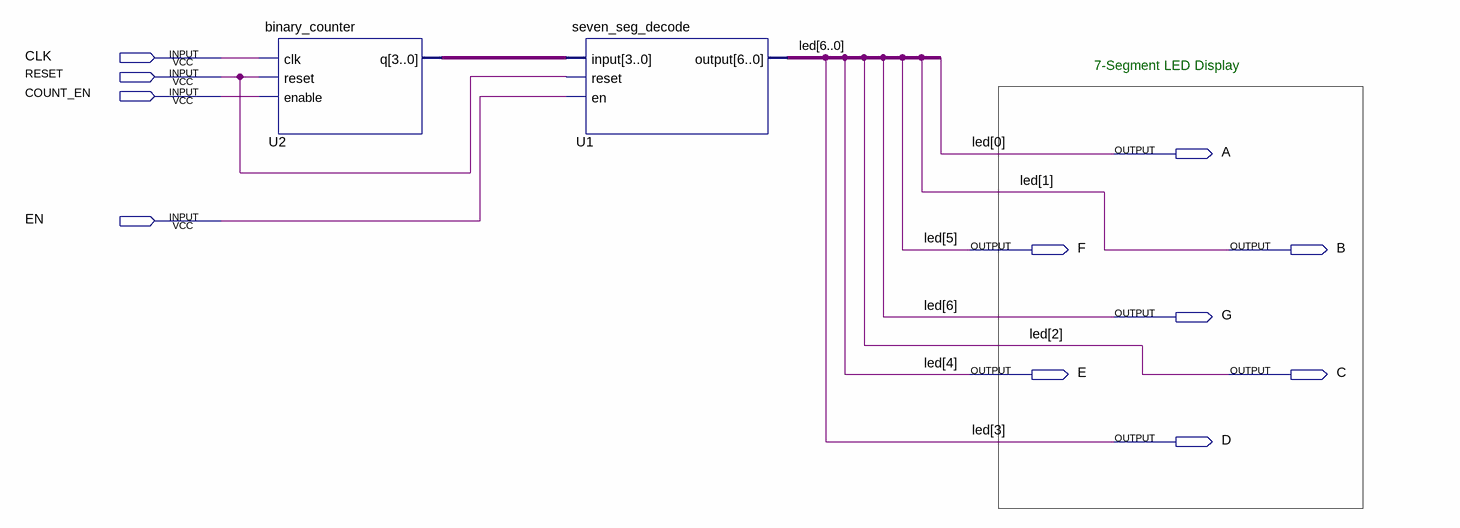
[diagram p0: schematic sheet]
// Quartus schematic task01.bdf as structural Verilog: 2 symbols, 11 pins
module task01 (
  input  CLK,
  input  RESET,
  input  COUNT_EN,
  input  EN,
  output A,
  output F,
  output B,
  output G,
  output E,
  output C,
  output D
);

  wire [3:0] U2_q;

  binary_counter U2 (.clk(CLK), .reset(RESET), .enable(COUNT_EN), .q(U2_q));
  seven_seg_decode U1 (.\input (U2_q), .reset(RESET), .en(EN), .\output ({G, F, E, D, C, B, A}));

  // Other names for the same wires on the sheet: led[6:0] = {G, F, E, D, C, B, A}

  // Notes on the sheet:
  //   7-Segment LED Display
endmodule
